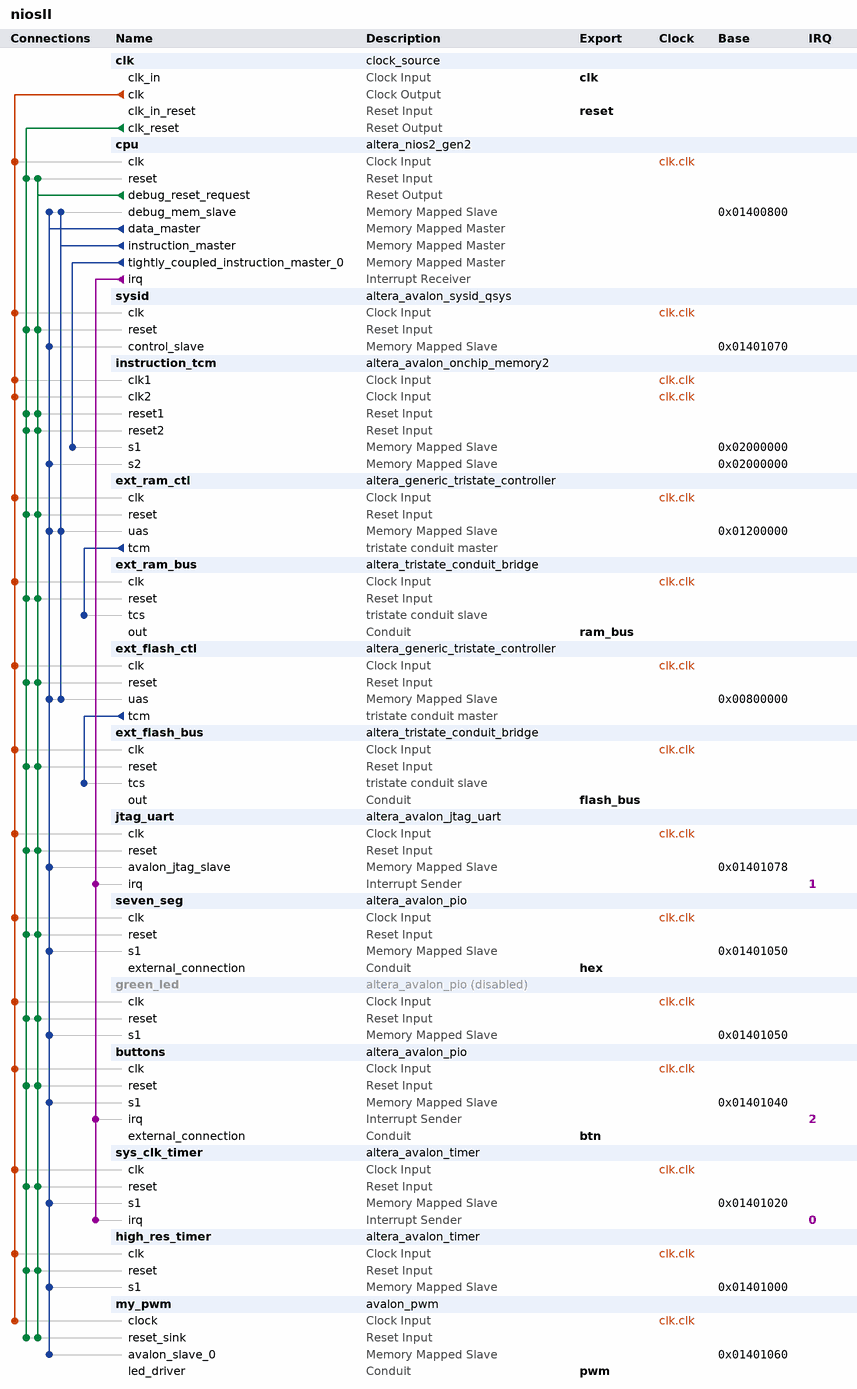
[diagram p0: system contents]
# Platform Designer (Qsys) system niosII, Cyclone IV E EP4CE115F29C7
# Parameters at their usual value, and those the tool derives, are not listed.
package require -exact qsys 15.0
create_system niosII
set_project_property DEVICE_FAMILY {Cyclone IV E}
set_project_property DEVICE EP4CE115F29C7

add_instance clk clock_source 15.0
set_instance_parameter_value clk clockFrequency 50000000

add_instance cpu altera_nios2_gen2 15.0
set_instance_parameter_value cpu dcache_size 4096
set_instance_parameter_value cpu debug_datatrigger 2
set_instance_parameter_value cpu debug_hwbreakpoint 2
set_instance_parameter_value cpu debug_traceType instruction_trace
set_instance_parameter_value cpu exceptionSlave ext_ram_ctl.uas
set_instance_parameter_value cpu icache_numTCIM 1
set_instance_parameter_value cpu icache_size 4096
set_instance_parameter_value cpu impl Fast
set_instance_parameter_value cpu resetSlave ext_flash_ctl.uas

add_instance sysid altera_avalon_sysid_qsys 15.0
set_instance_parameter_value sysid id 0

add_instance instruction_tcm altera_avalon_onchip_memory2 15.0
set_instance_parameter_value instruction_tcm dataWidth 32
set_instance_parameter_value instruction_tcm dualPort true
set_instance_parameter_value instruction_tcm initMemContent true
set_instance_parameter_value instruction_tcm initializationFileName onchip_mem.hex
set_instance_parameter_value instruction_tcm memorySize 16384

add_instance ext_ram_ctl altera_generic_tristate_controller 15.0
set_instance_parameter_value ext_ram_ctl ACTIVE_LOW_BEGINTRANSFER 0
set_instance_parameter_value ext_ram_ctl ACTIVE_LOW_BYTEENABLE 1
set_instance_parameter_value ext_ram_ctl ACTIVE_LOW_OUTPUTENABLE 1
set_instance_parameter_value ext_ram_ctl ACTIVE_LOW_READ 0
set_instance_parameter_value ext_ram_ctl CHIPSELECT_THROUGH_READLATENCY 0
set_instance_parameter_value ext_ram_ctl INTERFACE_ASSIGNMENT_KEYS embeddedsw.configuration.isMemoryDevice
set_instance_parameter_value ext_ram_ctl INTERFACE_ASSIGNMENT_VALUES 1
set_instance_parameter_value ext_ram_ctl MODULE_ASSIGNMENT_KEYS embeddedsw.CMacro.SRAM_MEMORY_SIZE,embeddedsw.CMacro.SRAM_MEMORY_UNITS,embeddedsw.CMacro.SRAM_DATA_WIDTH,embeddedsw.memoryInfo.MEM_INIT_DATA_WIDTH,embeddedsw.memoryInfo.HAS_BYTE_LANE,embeddedsw.memoryInfo.GENERATE_DAT_SYM,embeddedsw.memoryInfo.DAT_SYM_INSTALL_DIR
set_instance_parameter_value ext_ram_ctl MODULE_ASSIGNMENT_VALUES 2097152,1,16,16,1,1,SIM_DIR
set_instance_parameter_value ext_ram_ctl TCM_ADDRESS_W 21
set_instance_parameter_value ext_ram_ctl TCM_BYTEENABLE_W 2
set_instance_parameter_value ext_ram_ctl TCM_DATA_HOLD 10
set_instance_parameter_value ext_ram_ctl TCM_DATA_W 16
set_instance_parameter_value ext_ram_ctl TCM_MAX_PENDING_READ_TRANSACTIONS 3
set_instance_parameter_value ext_ram_ctl TCM_READLATENCY 2
set_instance_parameter_value ext_ram_ctl TCM_READ_WAIT 20
set_instance_parameter_value ext_ram_ctl TCM_SETUP_WAIT 5
set_instance_parameter_value ext_ram_ctl TCM_SYMBOLS_PER_WORD 2
set_instance_parameter_value ext_ram_ctl TCM_TIMING_UNITS 0
set_instance_parameter_value ext_ram_ctl TCM_TURNAROUND_TIME 2
set_instance_parameter_value ext_ram_ctl TCM_WRITE_WAIT 10
set_instance_parameter_value ext_ram_ctl USE_BEGINTRANSFER 0
set_instance_parameter_value ext_ram_ctl USE_BYTEENABLE 1
set_instance_parameter_value ext_ram_ctl USE_OUTPUTENABLE 1
set_instance_parameter_value ext_ram_ctl USE_READ 0

add_instance ext_ram_bus altera_tristate_conduit_bridge 15.0

add_instance ext_flash_ctl altera_generic_tristate_controller 15.0
set_instance_parameter_value ext_flash_ctl ACTIVE_LOW_BEGINTRANSFER 0
set_instance_parameter_value ext_flash_ctl ACTIVE_LOW_BYTEENABLE 0
set_instance_parameter_value ext_flash_ctl ACTIVE_LOW_OUTPUTENABLE 1
set_instance_parameter_value ext_flash_ctl ACTIVE_LOW_READ 1
set_instance_parameter_value ext_flash_ctl ACTIVE_LOW_RESET_OUTPUT 1
set_instance_parameter_value ext_flash_ctl CHIPSELECT_THROUGH_READLATENCY 0
set_instance_parameter_value ext_flash_ctl INTERFACE_ASSIGNMENT_KEYS embeddedsw.configuration.isFlash,embeddedsw.configuration.isMemoryDevice,embeddedsw.configuration.isNonVolatileStorage
set_instance_parameter_value ext_flash_ctl INTERFACE_ASSIGNMENT_VALUES 1,1,1
set_instance_parameter_value ext_flash_ctl MODULE_ASSIGNMENT_KEYS embeddedsw.configuration.hwClassnameDriverSupportList,embeddedsw.configuration.hwClassnameDriverSupportDefault,embeddedsw.CMacro.SIZE,embeddedsw.memoryInfo.MEM_INIT_DATA_WIDTH,embeddedsw.memoryInfo.HAS_BYTE_LANE,embeddedsw.memoryInfo.IS_FLASH,embeddedsw.memoryInfo.GENERATE_DAT_SYM,embeddedsw.memoryInfo.GENERATE_FLASH,embeddedsw.memoryInfo.DAT_SYM_INSTALL_DIR,embeddedsw.memoryInfo.FLASH_INSTALL_DIR
set_instance_parameter_value ext_flash_ctl MODULE_ASSIGNMENT_VALUES altera_avalon_lan91c111:altera_avalon_cfi_flash,altera_avalon_cfi_flash,8388608,8,0,1,1,1,SIM_DIR,APP_DIR
set_instance_parameter_value ext_flash_ctl TCM_ADDRESS_W 23
set_instance_parameter_value ext_flash_ctl TCM_BYTEENABLE_W 1
set_instance_parameter_value ext_flash_ctl TCM_DATA_HOLD 40
set_instance_parameter_value ext_flash_ctl TCM_DATA_W 8
set_instance_parameter_value ext_flash_ctl TCM_MAX_PENDING_READ_TRANSACTIONS 3
set_instance_parameter_value ext_flash_ctl TCM_READLATENCY 2
set_instance_parameter_value ext_flash_ctl TCM_READ_WAIT 90
set_instance_parameter_value ext_flash_ctl TCM_SETUP_WAIT 40
set_instance_parameter_value ext_flash_ctl TCM_SYMBOLS_PER_WORD 1
set_instance_parameter_value ext_flash_ctl TCM_TIMING_UNITS 0
set_instance_parameter_value ext_flash_ctl TCM_TURNAROUND_TIME 2
set_instance_parameter_value ext_flash_ctl TCM_WRITE_WAIT 90
set_instance_parameter_value ext_flash_ctl USE_BEGINTRANSFER 0
set_instance_parameter_value ext_flash_ctl USE_BYTEENABLE 0
set_instance_parameter_value ext_flash_ctl USE_OUTPUTENABLE 1
set_instance_parameter_value ext_flash_ctl USE_READ 1
set_instance_parameter_value ext_flash_ctl USE_RESET_OUTPUT 1

add_instance ext_flash_bus altera_tristate_conduit_bridge 15.0

add_instance jtag_uart altera_avalon_jtag_uart 15.0
set_instance_parameter_value jtag_uart simInteractiveOptions NO_INTERACTIVE_WINDOWS

add_instance seven_seg altera_avalon_pio 15.0
set_instance_parameter_value seven_seg direction Output
set_instance_parameter_value seven_seg resetValue 4294967295
set_instance_parameter_value seven_seg width 32

add_instance green_led altera_avalon_pio 15.0
set_instance_property green_led ENABLED false
set_instance_parameter_value green_led direction Output
set_instance_parameter_value green_led width 8

add_instance buttons altera_avalon_pio 15.0
set_instance_parameter_value buttons captureEdge true
set_instance_parameter_value buttons direction Input
set_instance_parameter_value buttons edgeType FALLING
set_instance_parameter_value buttons generateIRQ true
set_instance_parameter_value buttons irqType EDGE
set_instance_parameter_value buttons width 4

add_instance sys_clk_timer altera_avalon_timer 15.0
set_instance_parameter_value sys_clk_timer period 1
set_instance_parameter_value sys_clk_timer periodUnits MSEC

add_instance high_res_timer altera_avalon_timer 15.0
set_instance_parameter_value high_res_timer period 1
set_instance_parameter_value high_res_timer periodUnits USEC

add_instance my_pwm avalon_pwm 1.0

# connections
add_connection clk.clk buttons.clk clock
add_connection clk.clk cpu.clk clock
add_connection clk.clk ext_flash_bus.clk clock
add_connection clk.clk ext_flash_ctl.clk clock
add_connection clk.clk ext_ram_bus.clk clock
add_connection clk.clk ext_ram_ctl.clk clock
add_connection clk.clk green_led.clk clock
add_connection clk.clk high_res_timer.clk clock
add_connection clk.clk instruction_tcm.clk1 clock
add_connection clk.clk instruction_tcm.clk2 clock
add_connection clk.clk jtag_uart.clk clock
add_connection clk.clk my_pwm.clock clock
add_connection clk.clk seven_seg.clk clock
add_connection clk.clk sys_clk_timer.clk clock
add_connection clk.clk sysid.clk clock
add_connection clk.clk_reset buttons.reset reset
add_connection clk.clk_reset cpu.reset reset
add_connection clk.clk_reset ext_flash_bus.reset reset
add_connection clk.clk_reset ext_flash_ctl.reset reset
add_connection clk.clk_reset ext_ram_bus.reset reset
add_connection clk.clk_reset ext_ram_ctl.reset reset
add_connection clk.clk_reset green_led.reset reset
add_connection clk.clk_reset high_res_timer.reset reset
add_connection clk.clk_reset instruction_tcm.reset1 reset
add_connection clk.clk_reset instruction_tcm.reset2 reset
add_connection clk.clk_reset jtag_uart.reset reset
add_connection clk.clk_reset my_pwm.reset_sink reset
add_connection clk.clk_reset seven_seg.reset reset
add_connection clk.clk_reset sys_clk_timer.reset reset
add_connection clk.clk_reset sysid.reset reset
add_connection cpu.debug_reset_request buttons.reset reset
add_connection cpu.debug_reset_request cpu.reset reset
add_connection cpu.debug_reset_request ext_flash_bus.reset reset
add_connection cpu.debug_reset_request ext_flash_ctl.reset reset
add_connection cpu.debug_reset_request ext_ram_bus.reset reset
add_connection cpu.debug_reset_request ext_ram_ctl.reset reset
add_connection cpu.debug_reset_request green_led.reset reset
add_connection cpu.debug_reset_request high_res_timer.reset reset
add_connection cpu.debug_reset_request instruction_tcm.reset1 reset
add_connection cpu.debug_reset_request instruction_tcm.reset2 reset
add_connection cpu.debug_reset_request jtag_uart.reset reset
add_connection cpu.debug_reset_request my_pwm.reset_sink reset
add_connection cpu.debug_reset_request seven_seg.reset reset
add_connection cpu.debug_reset_request sys_clk_timer.reset reset
add_connection cpu.debug_reset_request sysid.reset reset
add_connection cpu.data_master buttons.s1 avalon
set_connection_parameter_value cpu.data_master/buttons.s1 baseAddress 0x01401040
add_connection cpu.data_master cpu.debug_mem_slave avalon
set_connection_parameter_value cpu.data_master/cpu.debug_mem_slave baseAddress 0x01400800
add_connection cpu.data_master ext_flash_ctl.uas avalon
set_connection_parameter_value cpu.data_master/ext_flash_ctl.uas baseAddress 0x00800000
add_connection cpu.data_master ext_ram_ctl.uas avalon
set_connection_parameter_value cpu.data_master/ext_ram_ctl.uas baseAddress 0x01200000
add_connection cpu.data_master green_led.s1 avalon
set_connection_parameter_value cpu.data_master/green_led.s1 baseAddress 0x01401050
add_connection cpu.data_master high_res_timer.s1 avalon
set_connection_parameter_value cpu.data_master/high_res_timer.s1 baseAddress 0x01401000
add_connection cpu.data_master instruction_tcm.s2 avalon
set_connection_parameter_value cpu.data_master/instruction_tcm.s2 baseAddress 0x02000000
add_connection cpu.data_master jtag_uart.avalon_jtag_slave avalon
set_connection_parameter_value cpu.data_master/jtag_uart.avalon_jtag_slave baseAddress 0x01401078
add_connection cpu.data_master my_pwm.avalon_slave_0 avalon
set_connection_parameter_value cpu.data_master/my_pwm.avalon_slave_0 baseAddress 0x01401060
add_connection cpu.data_master seven_seg.s1 avalon
set_connection_parameter_value cpu.data_master/seven_seg.s1 baseAddress 0x01401050
add_connection cpu.data_master sys_clk_timer.s1 avalon
set_connection_parameter_value cpu.data_master/sys_clk_timer.s1 baseAddress 0x01401020
add_connection cpu.data_master sysid.control_slave avalon
set_connection_parameter_value cpu.data_master/sysid.control_slave baseAddress 0x01401070
add_connection cpu.instruction_master cpu.debug_mem_slave avalon
set_connection_parameter_value cpu.instruction_master/cpu.debug_mem_slave baseAddress 0x01400800
add_connection cpu.instruction_master ext_flash_ctl.uas avalon
set_connection_parameter_value cpu.instruction_master/ext_flash_ctl.uas baseAddress 0x00800000
add_connection cpu.instruction_master ext_ram_ctl.uas avalon
set_connection_parameter_value cpu.instruction_master/ext_ram_ctl.uas baseAddress 0x01200000
add_connection cpu.tightly_coupled_instruction_master_0 instruction_tcm.s1 avalon
set_connection_parameter_value cpu.tightly_coupled_instruction_master_0/instruction_tcm.s1 baseAddress 0x02000000
add_connection cpu.irq buttons.irq interrupt
set_connection_parameter_value cpu.irq/buttons.irq irqNumber 2
add_connection cpu.irq jtag_uart.irq interrupt
set_connection_parameter_value cpu.irq/jtag_uart.irq irqNumber 1
add_connection cpu.irq sys_clk_timer.irq interrupt
set_connection_parameter_value cpu.irq/sys_clk_timer.irq irqNumber 0
add_connection ext_flash_ctl.tcm ext_flash_bus.tcs tristate_conduit
add_connection ext_ram_ctl.tcm ext_ram_bus.tcs tristate_conduit

# exported interfaces
add_interface btn conduit end
set_interface_property btn EXPORT_OF buttons.external_connection
add_interface clk clock sink
set_interface_property clk EXPORT_OF clk.clk_in
add_interface flash_bus conduit end
set_interface_property flash_bus EXPORT_OF ext_flash_bus.out
add_interface hex conduit end
set_interface_property hex EXPORT_OF seven_seg.external_connection
add_interface pwm conduit end
set_interface_property pwm EXPORT_OF my_pwm.led_driver
add_interface ram_bus conduit end
set_interface_property ram_bus EXPORT_OF ext_ram_bus.out
add_interface reset reset sink
set_interface_property reset EXPORT_OF clk.clk_in_reset

set_interconnect_requirement {$system} qsys_mm.clockCrossingAdapter HANDSHAKE
set_interconnect_requirement {$system} qsys_mm.enableEccProtection FALSE
set_interconnect_requirement {$system} qsys_mm.insertDefaultSlave FALSE
set_interconnect_requirement {$system} qsys_mm.maxAdditionalLatency 1

save_system niosII.qsys
